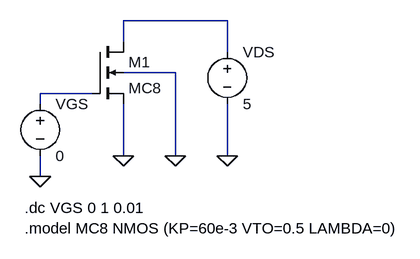
[diagram p0: schematic MOSFET_transfer.asc]
MOSFET_transfer.asc, the LTspice schematic file:
Version 4
SHEET 1 1412 680
WIRE 320 80 160 80
WIRE 160 112 160 80
WIRE 320 128 320 80
WIRE 240 160 160 160
WIRE 112 192 32 192
WIRE 32 208 32 192
WIRE 160 288 160 208
WIRE 240 288 240 160
WIRE 320 288 320 208
WIRE 32 320 32 288
FLAG 32 320 0
FLAG 160 288 0
FLAG 320 288 0
FLAG 240 288 0
SYMBOL voltage 32 192 R0
WINDOW 123 0 0 Left 0
WINDOW 39 0 0 Left 0
SYMATTR InstName VGS
SYMATTR Value 0
SYMBOL voltage 320 112 R0
WINDOW 123 0 0 Left 0
WINDOW 39 0 0 Left 0
SYMATTR InstName VDS
SYMATTR Value 5
SYMBOL nmos4 112 112 R0
SYMATTR InstName M1
SYMATTR Value MC8
TEXT 8 368 Left 2 !.dc VGS 0 1 0.01
TEXT 8 400 Left 2 !.model MC8 NMOS (KP=60e-3 VTO=0.5 LAMBDA=0)

The netlist it stands for:
* MOSFET_transfer.asc
VGS N002 0 0
VDS N001 0 5
M1 N001 N002 0 0 MC8
.model NMOS NMOS
.model PMOS PMOS
.lib standard.mos
.dc VGS 0 1 0.01
.model MC8 NMOS (KP=60e-3 VTO=0.5 LAMBDA=0)
.backanno
.end